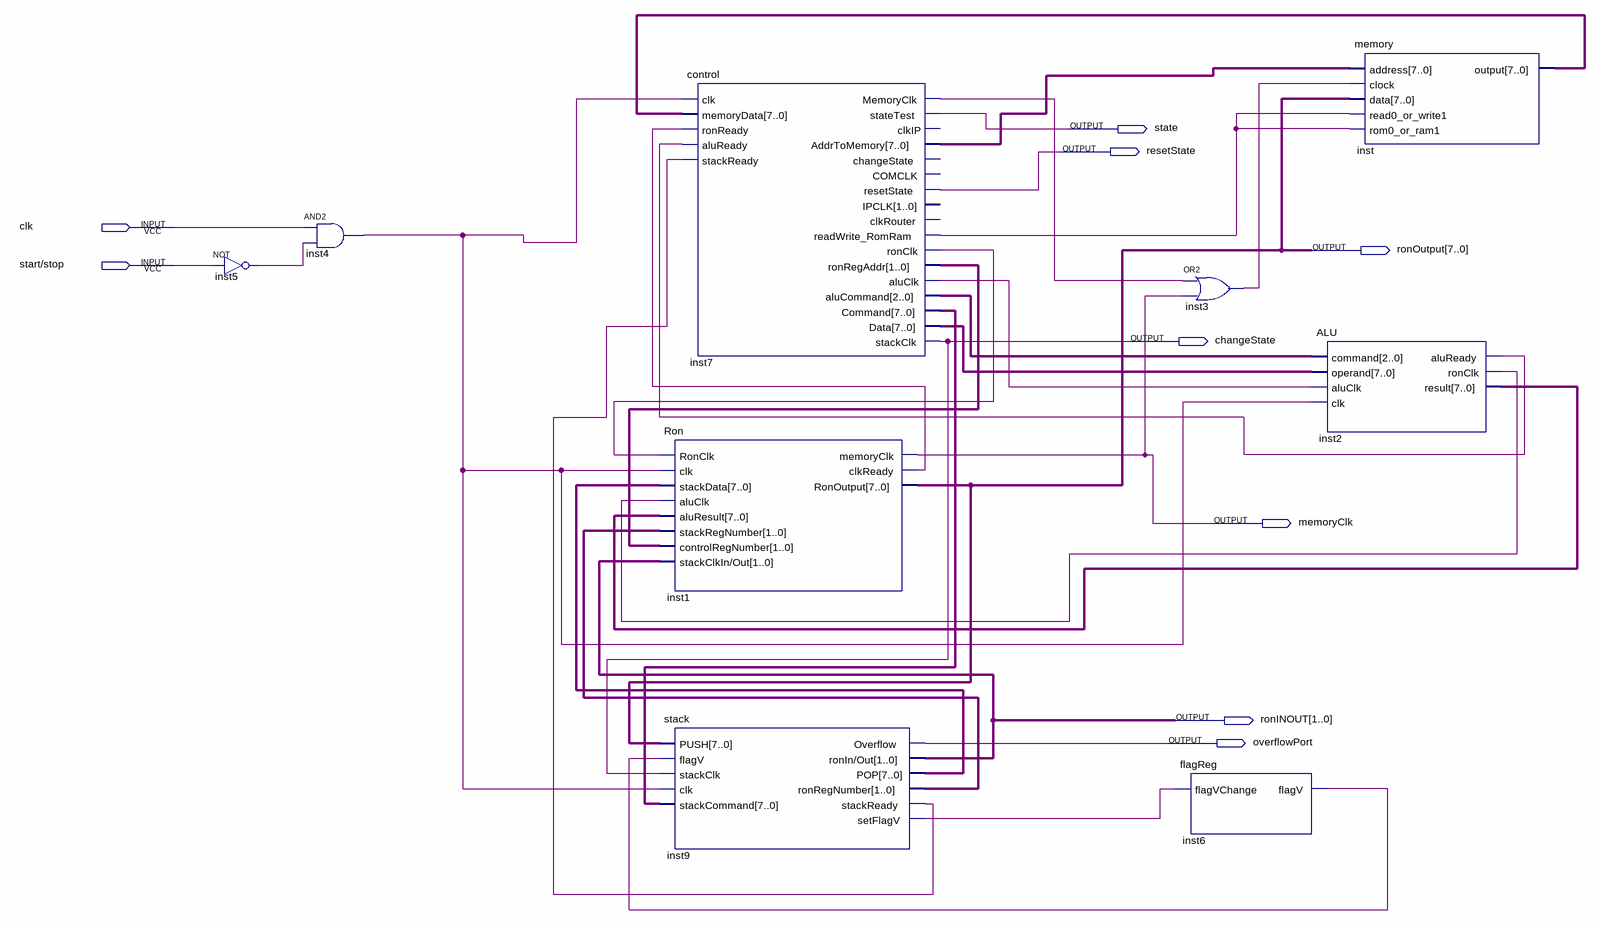
[diagram p0: schematic sheet]
// Quartus schematic main.bdf as structural Verilog: 9 symbols, 9 pins
module main (
  input  clk,
  input  \start/stop ,
  output state,
  output resetState,
  output [7:0] ronOutput,
  output changeState,
  output memoryClk,
  output [1:0] ronINOUT,
  output overflowPort
);

  wire inst1_clkready, inst2_aluready, inst2_ronclk, inst3_out, inst4_out, inst5_out, inst6_flagv,
       inst7_aluclk, inst7_memoryclk, inst7_readwrite_romram, inst7_ronclk, inst9_setflagv, inst9_stackready;
  wire [1:0] inst7_ronregaddr, inst9_ronregnumber;
  wire [2:0] inst7_alucommand;
  wire [7:0] inst2_result, inst7_addrtomemory, inst7_command, inst7_data, inst9_pop, inst_output;

  not inst5 (inst5_out, \start/stop );
  and inst4 (inst4_out, clk, inst5_out);
  control inst7 (
    .clk(inst4_out), .memoryData(inst_output), .ronReady(inst1_clkready), .aluReady(inst2_aluready),
    .stackReady(inst9_stackready), .MemoryClk(inst7_memoryclk), .stateTest(state),
    .AddrToMemory(inst7_addrtomemory), .resetState(resetState), .readWrite_RomRam(inst7_readwrite_romram),
    .ronClk(inst7_ronclk), .ronRegAddr(inst7_ronregaddr), .aluClk(inst7_aluclk),
    .aluCommand(inst7_alucommand), .Command(inst7_command), .Data(inst7_data), .stackClk(changeState));  // open: clkIP, changeState, COMCLK, IPCLK, clkRouter
  Ron inst1 (
    .RonClk(inst7_ronclk), .clk(inst4_out), .stackData(inst9_pop), .aluClk(inst2_ronclk),
    .aluResult(inst2_result), .stackRegNumber(inst9_ronregnumber), .controlRegNumber(inst7_ronregaddr),
    .\stackClkIn/Out (ronINOUT), .memoryClk(memoryClk), .clkReady(inst1_clkready), .RonOutput(ronOutput));
  stack inst9 (
    .PUSH(ronOutput), .flagV(inst6_flagv), .stackClk(changeState), .clk(inst4_out),
    .stackCommand(inst7_command), .Overflow(overflowPort), .\ronIn/Out (ronINOUT), .POP(inst9_pop),
    .ronRegNumber(inst9_ronregnumber), .stackReady(inst9_stackready), .setFlagV(inst9_setflagv));
  or inst3 (inst3_out, inst7_memoryclk, memoryClk);
  flagReg inst6 (.flagVChange(inst9_setflagv), .flagV(inst6_flagv));
  ALU inst2 (
    .command(inst7_alucommand), .operand(inst7_data), .aluClk(inst7_aluclk), .clk(inst4_out),
    .aluReady(inst2_aluready), .ronClk(inst2_ronclk), .result(inst2_result));
  memory inst (
    .address(inst7_addrtomemory), .clock(inst3_out), .data(ronOutput),
    .read0_or_write1(inst7_readwrite_romram), .rom0_or_ram1(inst7_readwrite_romram), .\output (inst_output));
endmodule
